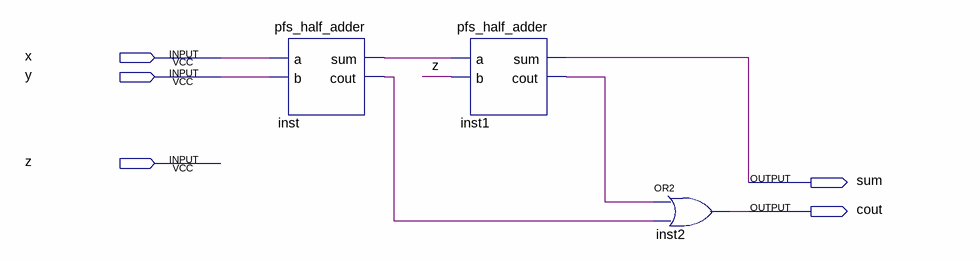
[diagram p0: schematic sheet]
// Quartus schematic pfs_full_adder.bdf as structural Verilog: 3 symbols, 5 pins
module pfs_full_adder (
  input  x,
  input  y,
  input  z,
  output sum,
  output cout
);

  wire inst1_cout, inst_cout, inst_sum;

  pfs_half_adder inst (.a(x), .b(y), .sum(inst_sum), .cout(inst_cout));
  pfs_half_adder inst1 (.a(inst_sum), .b(z), .sum(sum), .cout(inst1_cout));
  or inst2 (cout, inst1_cout, inst_cout);
endmodule
